# EasyEDA schematic extension_dfplayer.json
TITLE: Sheet_1; REV: 1.0; Date: 2025-11-14; Sheet: 1/1; Drawn By: nath8505; Company: Your Company
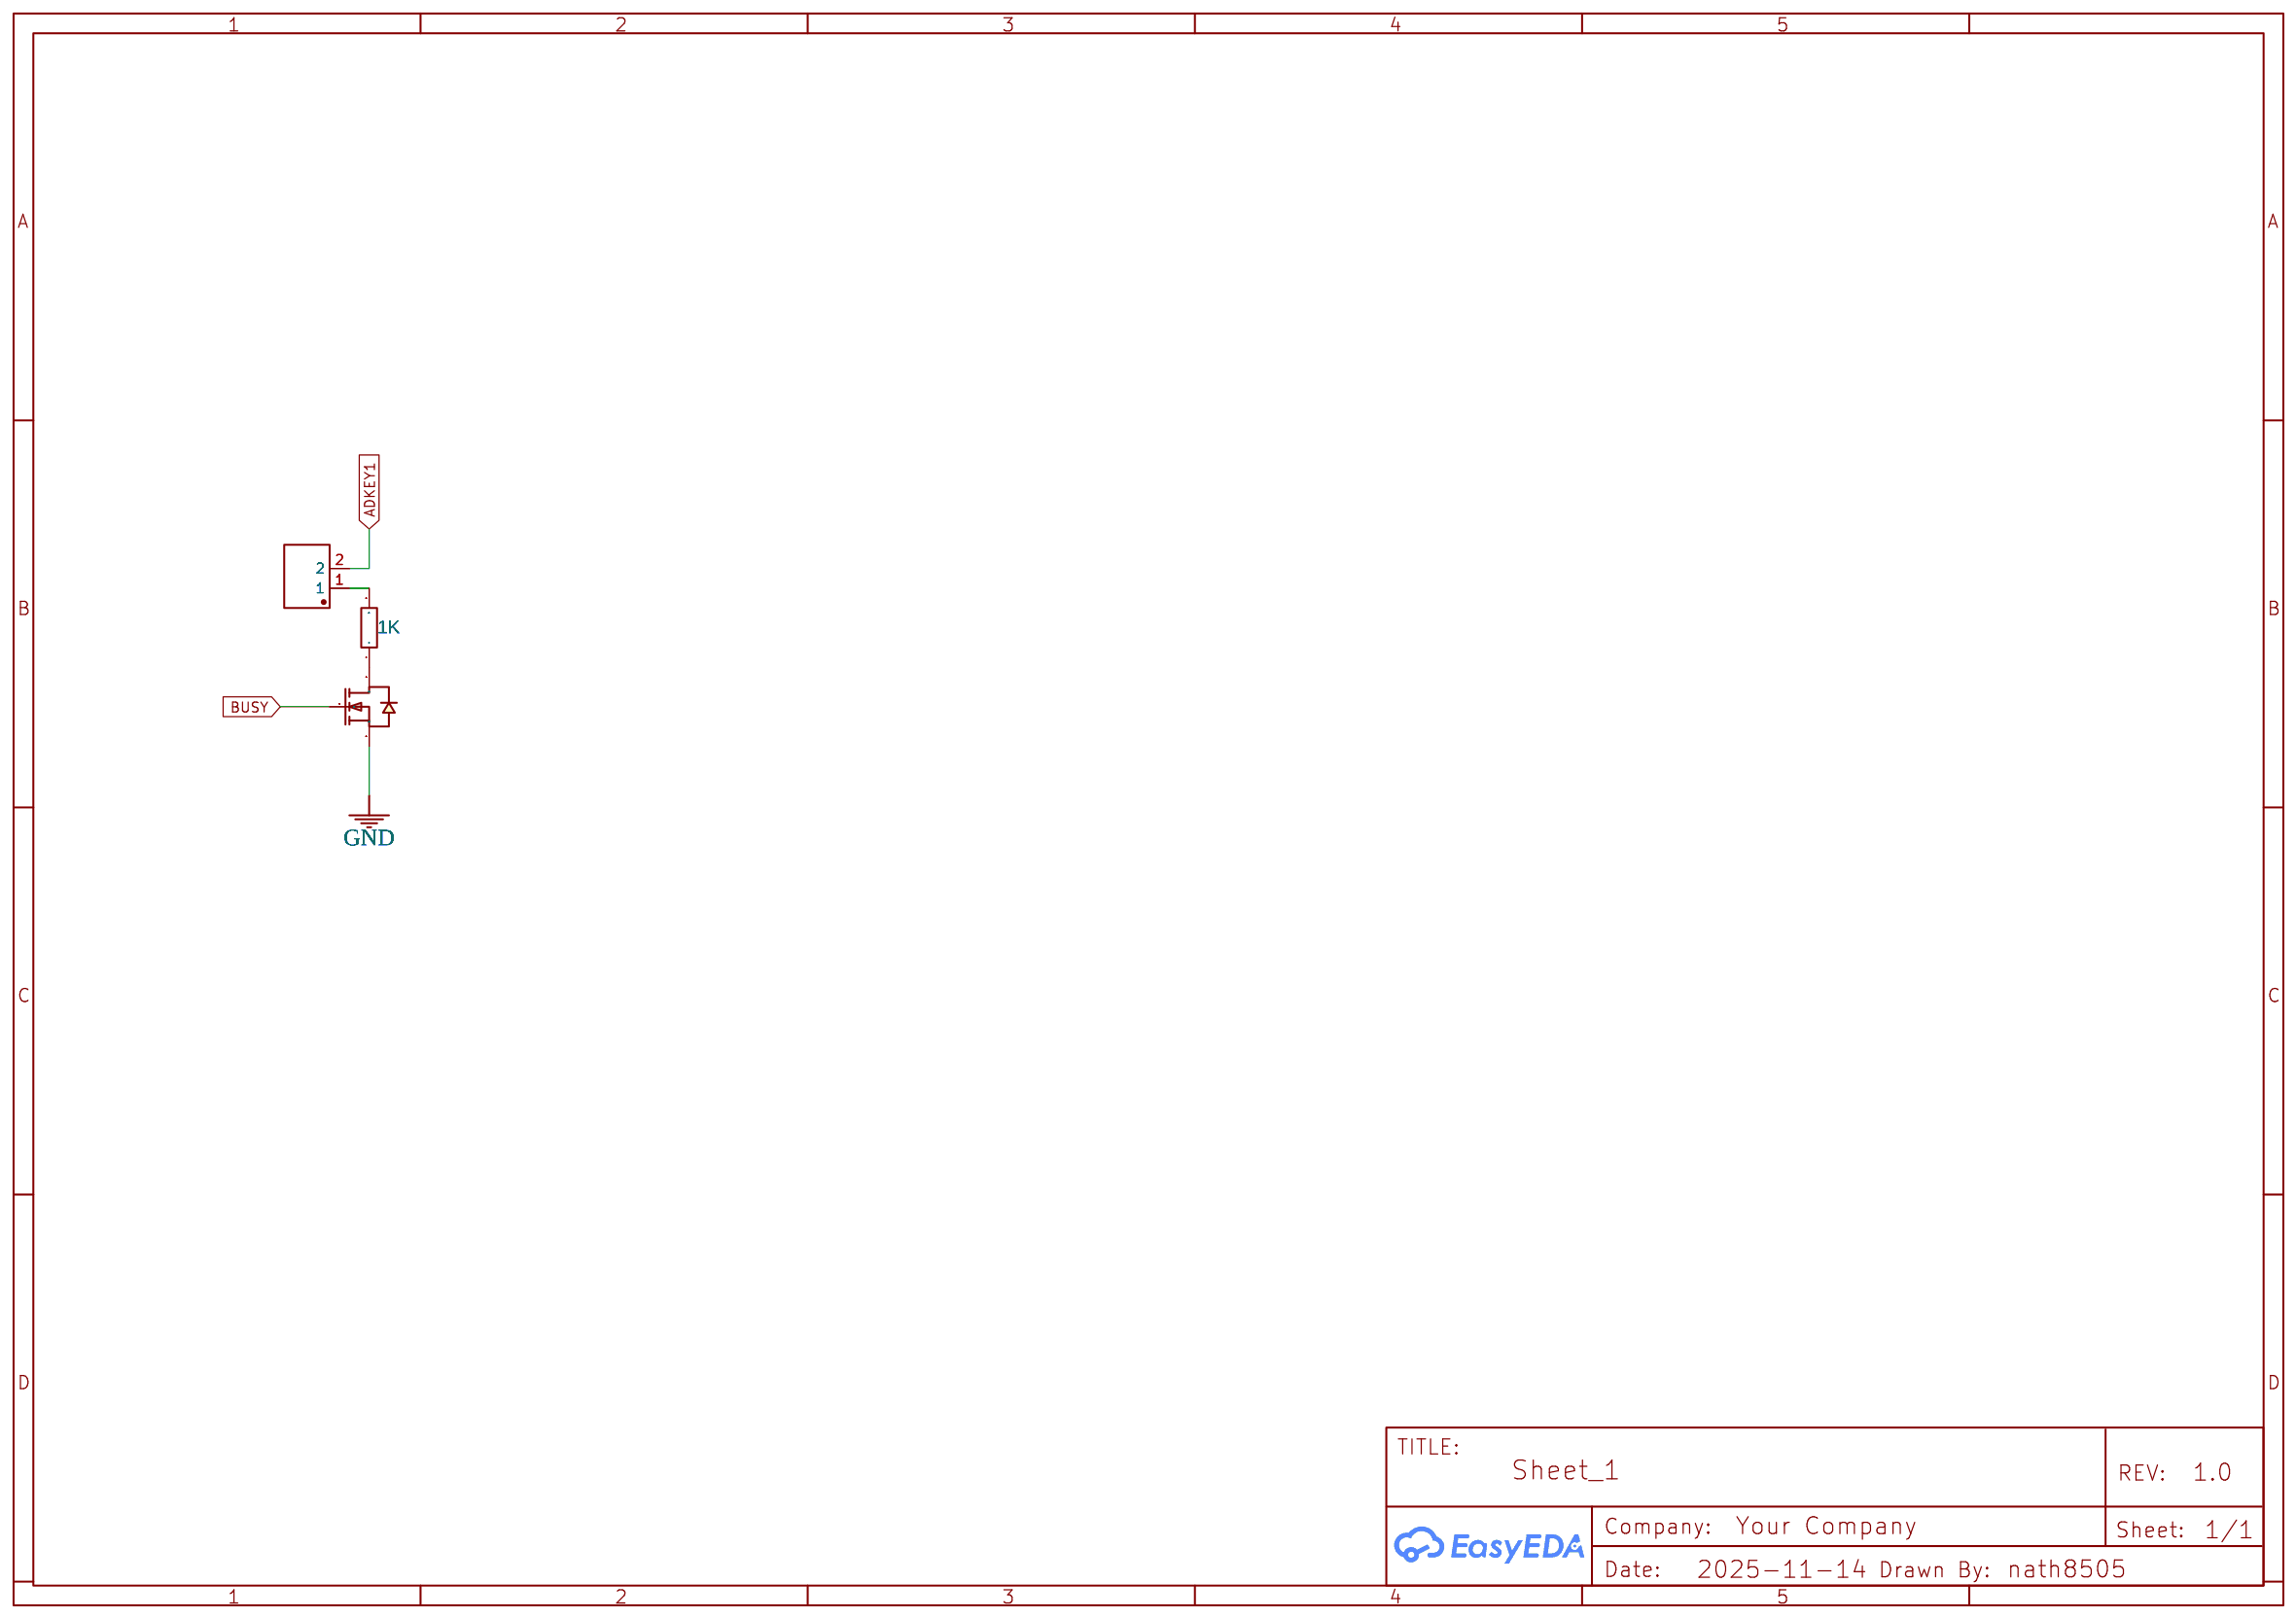
[diagram p0: schematic sheet]

## Parts
ECON1  D_OUT8  [CONN-TH_KF2510-2A]
EQ1  Q  [SOT-23-3_L2.9-W1.3-P0.95-LS2.4-BR]
ERL1  1K  [R0603]

## Library data of the parts
ECON1 = KF2510-2A: Supplier: LCSC; Manufacturer: BOOMELE; Supplier Part: C27543; JLCPCB Part Class: Extended Part; Package Display: No
EQ1 = JSM2302: Supplier: LCSC; Supplier Part: C5224189; Manufacturer: ElecSuper(静芯微）; Manufacturer Part: AO3400; Contributor: LCSC; JLCPCB Part Class: Extended Part; Package Display: No
ERL1 = 0603WAF1001T5E: Supplier: LCSC; Manufacturer: UniOhm; Supplier Part: C21190; JLCPCB Part Class: Basic Part; Package Display: No

## Nets
GND: EQ1.2(S)
ADKEY1: ECON1.2
BUSY: EQ1.1(G)
Net-(ECON1-1): ECON1.1 ERL1.2
Net-(EQ1-3): EQ1.3(D) ERL1.1
